# Altium schematic sheet Connectors.SchDoc
size A; SheetNumber: 1; SheetTotal: 6
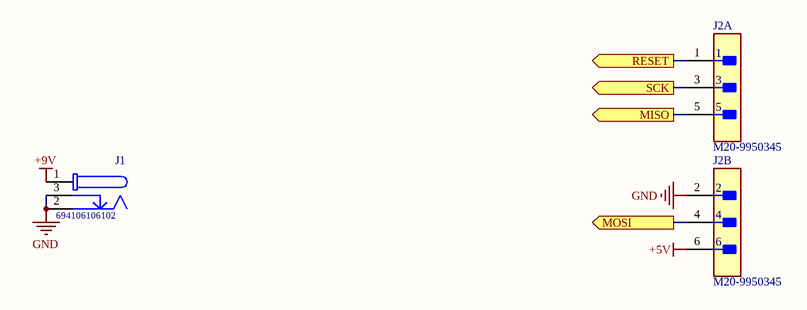
[diagram p0: Connectors.SchDoc]

## Parts
J1  694106106102  [694106106102]
J2  M20-9950345  [FP-M20-9950345-MFG]  (parts A,B of 2)

## Ports
MISO (out), MOSI (out), RESET (out), SCK (out)

## Nets
+5V: J2.6
+9V: J1.1
GND: J1.2 J1.3 J2.2
MISO: J2.5 ; port MISO
MOSI: J2.4 ; port MOSI
RESET: J2.1 ; port RESET
SCK: J2.3 ; port SCK

## Library data of the parts
J1 = CMP-1502-00177-1: DC Power Jack Connector with 4 soldering pads & Pegs WR-DC, Male, Right Angled, SMT, 5 A, 24 V; Manufacturer: Wurth Elektronik; Working Voltage: 24V; Rated Current: 5A; Plug Inner Diameter: 2.05mm; Plug Outer Diameter: 5.5mm; Opening Diameter: 6.4mm; Packaging: TapeandReel; Package Reference: 694106106102; Datasheet URL: http://katalog.we-online.de/em/datasheet/6941xx106102.pdf; Operating Temperature: -40to85degC; Orientation: RightAngled; Part Number: 694106106102; Mounting Technology: SMT; Publisher: WurthElektronik; Manufacturer URL: http://www.we-online.de; Gender: Male
J2 = CMP-15831-000002-1: CONN HEADER R/A 6POS 2.54MM; Manufacturer: Harwin; Conn Gender: Male; Number Of Contacts: 6; Conn Orientation: Right Angle; Current Rating: 3A; Description: 6 Positions Header, Unshrouded, Breakaway Connector 0.100" (2.54mm) Through Hole, Right Angle Gold; Device Class L2: Headers and Wire Housings; Temperature: -40°C to +105°C; Device Class L1: Connectors; RoHS: TRUE; Temperature Range Low: -40°C; ComponentLink2URL: https://cdn.harwin.com/pdfs/M20-995.pdf; Height: 5.28mm; Digikey Description: CONN HEADER R/A 6POS 2.54MM; Pitch: 2.54mm; Manufacturer Part Number: M20-9950345; Device Class L3: unset; Ipc Land Pattern Name: DFN400X400X80-14; Automotive: No; Octopart: https://octopart.com/m20-9950345-harwin-21265213; Category: Conn; Mouser Description: Headers & Wire Housings 03+03 DIL HORIZONTAL PIN HEADER GOLD HT; Package: 0; Number Of Rows: 2; Contact Material: Gold,Nickel; Lead Free: Yes; ComponentLink2Description: Datasheet; Temperature Range High: +105°C